# Altium schematic sheet 1_fpga.SchDoc
size A4; SheetNumber: 2; SheetTotal: 13
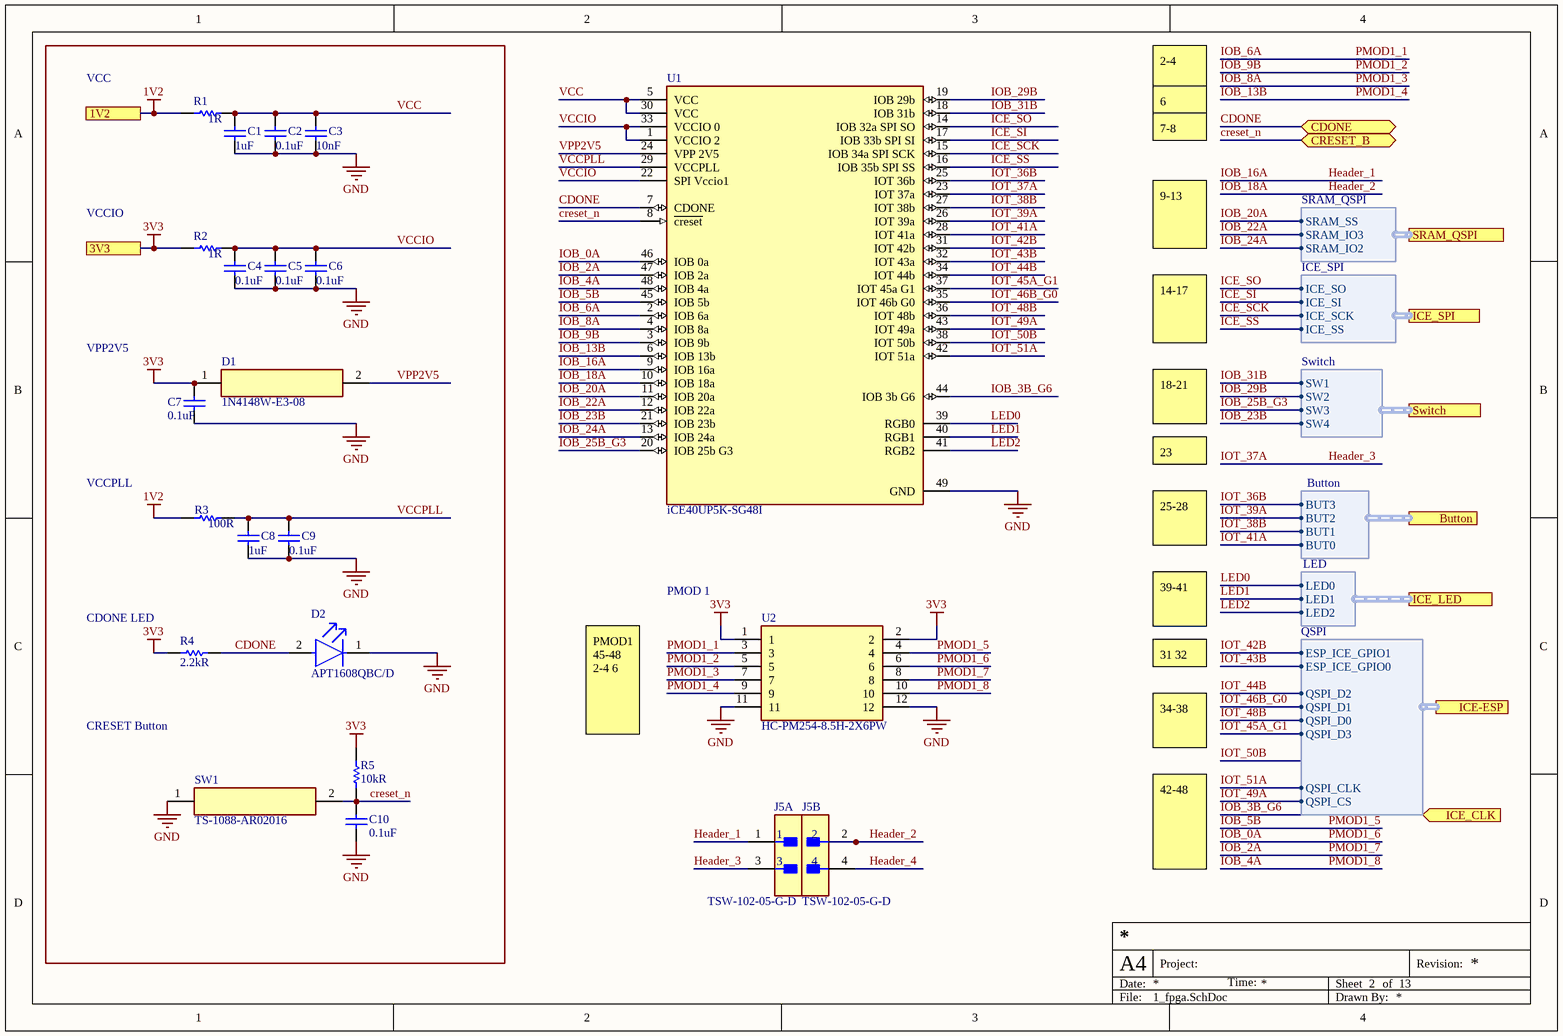
[diagram p0: 1_fpga.SchDoc]

## Parts
C1  1uF  [CAPC1609X100X15NL20]
C2  0.1uF  [CAPC1609X100X15NL20]
C3  10nF  [CAPC1609X100X15NL20]
C4  0.1uF  [CAPC1609X100X15NL20]
C5  0.1uF  [CAPC1609X100X15NL20]
C6  0.1uF  [CAPC1609X100X15NL20]
C7  0.1uF  [CAPC1609X100X15NL20]
C8  1uF  [CAPC1609X100X15NL20]
C9  0.1uF  [CAPC1609X100X15NL20]
C10  0.1uF  [CAPC1609X100X15NL20]
D1  1N4148W-E3-08  [SOD-123_L2.8-W1.8-LS3.7-RD]
D2  APT1608QBC/D  [FP-APT1608QBC-D-MFG]
J5  TSW-102-05-G-D  [FP-TSW-102-05-G-D-MFG]  (parts A,B of 2)
R1  1R  [RESC1609X55X30NL10T20]
R2  1R  [RESC1609X55X30NL10T20]
R3  100R  [RESC1609X55X30NL10T20]
R4  2.2kR  [RESC1609X55X30NL10T20]
R5  10kR  [RESC1609X55X30NL10T20]
SW1  TS-1088-AR02016  [SW-SMD_L3.9-W3.0-P4.45]
U1  iCE40UP5K-SG48I  [FP-QFN-48-IPC_C]
U2  HC-PM254-8.5H-2X6PW  [CONN-TH_HC-PM254-8.5H-2X6PW]

## Ports
1V2, 3V3, Button (harness Button), CDONE (bidir), CRESET_B (bidir), ICE-ESP (harness QSPI), ICE_CLK (in), ICE_LED (harness LED), ICE_SPI (harness ICE_SPI), SRAM_QSPI (harness SRAM_QSPI), Switch (harness Switch)

## Harnesses
Switch: SW1, SW2, SW3, SW4
Button: BUT0, BUT2, BUT3, BUT1
ICE_SPI: ICE_SO, ICE_SI, ICE_SCK, ICE_SS
SRAM_QSPI: SRAM_IO3, SRAM_IO2, SRAM_SS
QSPI: QSPI_D3, QSPI_CS, QSPI_CLK, QSPI_D1, QSPI_D2, QSPI_D0, ESP_ICE_GPIO0, ESP_ICE_GPIO1
LED: LED2, LED0, LED1

## Nets
1V2: R1.1 R3.1 ; port 1V2
3V3: C7.2 D1.1(K) R2.1 R4.2 R5.1 U2.1 U2.2 ; port 3V3
GND: C1.1 C2.1 C3.1 C4.1 C5.1 C6.1 C7.1 C8.1 C9.1 C10.2 D2.1(C) SW1.1 U1.49(GND) U2.11 U2.12
CDONE: D2.2(A) R4.1 U1.7(CDONE) ; port CDONE
creset_n: C10.1 R5.2 SW1.2 U1.8(~{creset}) ; port CRESET_B
Header_1: J5.1 U1.9(IOB_16a)  [also labelled IOB_16A]
Header_2: J5.2 U1.10(IOB_18a)  [also labelled IOB_18A]
Header_3: J5.3 U1.23(IOT_37a)  [also labelled IOT_37A]
Header_4: J5.4 U1.38(IOT_50b)  [also labelled IOT_50B]
ICE_SCK: U1.15(IOB_34a_SPI_SCK) ; port ICE_SPI.ICE_SCK
ICE_SI: U1.17(IOB_33b_SPI_SI) ; port ICE_SPI.ICE_SI
ICE_SO: U1.14(IOB_32a_SPI_SO) ; port ICE_SPI.ICE_SO
ICE_SS: U1.16(IOB_35b_SPI_SS) ; port ICE_SPI.ICE_SS
IOB_0A: U1.46(IOB_0a) U2.6  [also labelled PMOD1_6]
IOB_2A: U1.47(IOB_2a) U2.8  [also labelled PMOD1_7]
IOB_3B_G6: U1.44(IOB_3b_G6) ; port ICE_CLK
IOB_4A: U1.48(IOB_4a) U2.10  [also labelled PMOD1_8]
IOB_5B: U1.45(IOB_5b) U2.4  [also labelled PMOD1_5]
IOB_6A: U1.2(IOB_6a) U2.3  [also labelled PMOD1_1]
IOB_8A: U1.4(IOB_8a) U2.7  [also labelled PMOD1_3]
IOB_9B: U1.3(IOB_9b) U2.5  [also labelled PMOD1_2]
IOB_13B: U1.6(IOB_13b) U2.9  [also labelled PMOD1_4]
IOB_20A: U1.11(IOB_20a) ; port SRAM_QSPI.SRAM_SS
IOB_22A: U1.12(IOB_22a) ; port SRAM_QSPI.SRAM_IO3
IOB_23B: U1.21(IOB_23b) ; port Switch.SW4
IOB_24A: U1.13(IOB_24a) ; port SRAM_QSPI.SRAM_IO2
IOB_25B_G3: U1.20(IOB_25b_G3) ; port Switch.SW3
IOB_29B: U1.19(IOB_29b) ; port Switch.SW2
IOB_31B: U1.18(IOB_31b) ; port Switch.SW1
IOT_36B: U1.25(IOT_36b) ; port Button.BUT3
IOT_38B: U1.27(IOT_38b) ; port Button.BUT1
IOT_39A: U1.26(IOT_39a) ; port Button.BUT2
IOT_41A: U1.28(IOT_41a) ; port Button.BUT0
IOT_42B: U1.31(IOT_42b) ; port ICE-ESP.ESP_ICE_GPIO1
IOT_43B: U1.32(IOT_43a) ; port ICE-ESP.ESP_ICE_GPIO0
IOT_44B: U1.34(IOT_44b) ; port ICE-ESP.QSPI_D2
IOT_45A_G1: U1.37(IOT_45a_G1) ; port ICE-ESP.QSPI_D3
IOT_46B_G0: U1.35(IOT_46b_G0) ; port ICE-ESP.QSPI_D1
IOT_48B: U1.36(IOT_48b) ; port ICE-ESP.QSPI_D0
IOT_49A: U1.43(IOT_49a) ; port ICE-ESP.QSPI_CS
IOT_51A: U1.42(IOT_51a) ; port ICE-ESP.QSPI_CLK
LED0: U1.39(RGB0) ; port ICE_LED.LED0
LED1: U1.40(RGB1) ; port ICE_LED.LED1
LED2: U1.41(RGB2) ; port ICE_LED.LED2
VCC: C1.2 C2.2 C3.2 R1.2 U1.5(VCC) U1.30(VCC)
VCCIO: C4.2 C5.2 C6.2 R2.2 U1.1(VCCIO_2) U1.22(SPI_Vccio1) U1.33(VCCIO_0)
VCCPLL: C8.2 C9.2 R3.2 U1.29(VCCPLL)
VPP2V5: D1.2(A) U1.24(VPP_2V5)

## Notes on the sheet
- VCC
- 2-4
- 6
- 7-8
- VCCIO
- 9-13
- VPP2V5
- 14-17
- 18-21
- VCCPLL
- 23
- 25-28
- (near R4) CDONE LED
- PMOD 1
- 39-41
- 31 32
- CRESET Button
- PMOD1
  45-48
  2-4 6
- 34-38
- 42-48
- Date:
- A4
- Project:
- Time:
- Sheet
- of
- Revision:
- File:
- Drawn By:

## Library data of the parts
C1-C10 = CMP-2006-00183-1: Manufacturer: AVX Interconnect / Elco; Part Number: TACL105K006XTA
D1 = CMP-004-00031-1: Diode Configuration:1 Independent Pd - Power Dissipation:350mW Current - Rectified:150mA Voltage - DC Reverse(Vr):75V Voltage - Forward(Vf@If):1.2V@100mA Non-Repetitive Peak Forward Surge Current:2A Reverse Leakage Current (Ir):100uA@100V Reverse Recovery; Manufacturer: VISHAY(威世); Current - Rectified: 150mA; Reverse Recovery Time (trr): 4ns; Operating Junction Temperature Range: -55℃~+150℃; Voltage - DC Reverse(Vr): 75V; Pd - Power Dissipation: 350mW; Non-Repetitive Peak Forward Surge Current: 2A; LCSC Part Name: 75V 150mA; Manufacturer Part: 1N4148W-E3-08; Diode Configuration: 1 Independent; Supplier Footprint: SOD-123; Datasheet: https://item.szlcsc.com/datasheet/1N4148W-E3-08/240783.html; Reverse Leakage Current (Ir): 100uA@100V; Voltage - Forward(Vf@If): 1.2V@100mA; Supplier Part: C241939; Design Item ID: 1N4148W-E3-08; Source: EasyEDA.schlib; JLCPCB Part Class: Extended Part
D2 = CMP-2000-05788-2: LED BLUE CLEAR CHIP SMD; Lens Style: Flat; Forward Current: 20mA; Luminous Intensity: 100mcd; Number of LEDs: 1; Dominant Wavelength: 465nm; Lens Color: Colorless; Forward Voltage: 3.3V; Viewing Angle: 120°; Case Code (Imperial): 0603; Number of Pins: 2; Length: 1.6mm; Mount: Surface Mount; Color: Blue; Width: 0.8mm; Height: 0.75mm; Case/Package: 0603; Lead Free: Lead Free; Case Code (Metric): 1608; Lens Transparency: Clear; Min Operating Temperature: -40°C; Packaging: Tape and Reel; Max Operating Temperature: 85°C; Package Quantity: 2000; Test Current: 20mA; Illumination Color: Blue
J5 = CMP-02766-001389-1: CONN HEADER VERT 4POS 2.54MM; Max Voltage Rating (AC): 550V; Connector Type: Male Pin; Row Spacing: 0.1inch; Max Current Rating: 7.6A; Number of Positions: 4; Gender: Male; Packaging: Bulk; Color: Black; Housing Material: Plastic; Contact Material: Bronze; Contact Plating: Gold; Housing Color: Black; Width: 5.08mm; Orientation: Straight; Pitch: 2.54mm; Lead Free: Lead Free; Series: TSW; Min Operating Temperature: -55°C; Contact Type: Male Pin; Height: 2.54mm; Termination: Solder; Number of Rows: 2; Contact Mating Length: 0.105inch; Package Quantity: 1; Length: 5.08mm; REACH SVHC: No SVHC; Mount: Through Hole; Radiation Hardening: No; Number of Contacts: 4; Max Operating Temperature: 125°C
R1-R5 = CMP-2000-03692-1: Manufacturer: Vishay Dale; Part Number: TNPW060310K0BEEN
SW1 = TS-1088-AR02016: Circuit:SPST Actuator Style:Round Button Operating Force:1.6N Mounting Type:Surface Mount,Vertical Length:3.9mm Width:3mm Switch Height:2mm with Bracket:Without Bracket Contact Current:50mA Voltage Rating:12V Actuator/Cap Color:Black With Lamp:- IP Rating; Manufacturer: XUNPU(讯普); Circuit: SPST; Operating Force: 1.6N; Switch Height: 2mm; Contact Current: 50mA; Voltage Rating: 12V; Actuator/Cap Color: Black; Life: 100,000 cycles; LCSC Part Name: 3.9*3*2mm 立贴 轻触开关; Supplier Part: C720477; Manufacturer Part: TS-1088-AR02016; Supplier Footprint: SMD,4x3mm; JLCPCB Part Class: Basic Part; Datasheet: https://item.szlcsc.com/datasheet/TS-1088-AR02016/763484.html; Supplier: LCSC; Actuator Style: Round Button; Mounting Type: Surface Mount,Vertical; Length: 3.9mm; Width: 3mm; with Bracket: Without Bracket; Termination Style: SMD(SMT) Tab; Operating Temperature: -30℃~+80℃
U1 = CMP-17932-000001-1: ICE40-ULTRAPLUS, 5280 LUTS, 1.2V; Manufacturer: Lattice; Propagation Delay: 9ns; Frequency: 48MHz; Max Junction Temp: +100°C; Ram Size: 1024Kbits; Number Of Logic Elements Cells: 5280; Number Of I/Os: 39; Max Supply Voltage: 3.46V; Standoff Height: 0mm; Nominal Supply Current: 2.5-12mA; Min Supply Voltage: 1.14V; Number Of Logic Blocks: 660; Device Class L3: FPGAs - Field Programmable Gate Arrays; Temperature Range High: +100°C; Device Class L1: Integrated Circuits (ICs); Device Class L2: Embedded Processors and Controllers; Ipc Land Pattern Name: QFN50P700X700X90-48; Automotive: No; RoHS: TRUE; Lead Free: Yes; Height: 1mm; ComponentLink2Description: Datasheet; Manufacturer Part Number: iCE40UP5K-SG48I; Temperature Range Low: -40°C; Package: QFN-48; Temperature: -40°C to +100°C; Octopart: https://octopart.com/ice40up5k-sg48i-lattice+semiconductor-87369311; Footprint Url: http://www.latticesemi.com/view_document?document_id=213; Digikey Description: ICE40-ULTRAPLUS, 5280 LUTS, 1.2V; ComponentLink2URL: http://www.latticesemi.com/view_document?document_id=51968; Category: IC
U2 = HC-PM254-8.5H-2X6PW: Holes Structure:2x6P Pitch:2.54mm Row Spacing:2.54mm Circular Hole / Square Hole:Square Hole Mounting Type:Right Angle Number of Rows:2 Number of Positions:12P Current Rating:3A Voltage Rating (Max):- Holes Direction:Side Insulation Height:5mm Contact Mat; Manufacturer: HC(虹成电子); Holes Structure: 2x6P; Pitch: 2.54mm; Number of Positions: 12P; Current Rating: 3A; Holes Direction: Side; PIN Length: 3mm; LCSC Part Name: 间距2.54mm 2x6Pin 弯插 PC3.2 PB12.7 H8.5; Supplier Part: C22373932; Manufacturer Part: HC-PM254-8.5H-2x6PW; Supplier Footprint: 弯插,P=2.54mm; JLCPCB Part Class: Extended Part; Datasheet: https://item.szlcsc.com/datasheet/HC-PM254-8.5H-2x6PW/23870269.html; Supplier: LCSC; Row Spacing: 2.54mm; Circular Hole / Square Hole: Square Hole; Mounting Type: Right Angle; Number of Rows: 2; Insulation Height: 5mm; Contact Material: Brass; Contact Plating: Gold; Operating Temperature: -40℃~+105℃